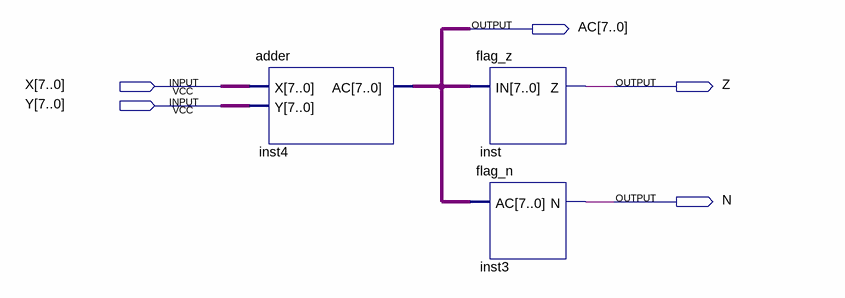
[diagram p0: schematic sheet]
// Quartus schematic test.bdf as structural Verilog: 3 symbols, 5 pins
module test (
  input  [7:0] X,
  input  [7:0] Y,
  output [7:0] AC,
  output Z,
  output N
);

  adder inst4 (.X(X), .Y(Y), .AC(AC));
  flag_z inst (.IN(AC), .Z(Z));
  flag_n inst3 (.AC(AC), .N(N));
endmodule
